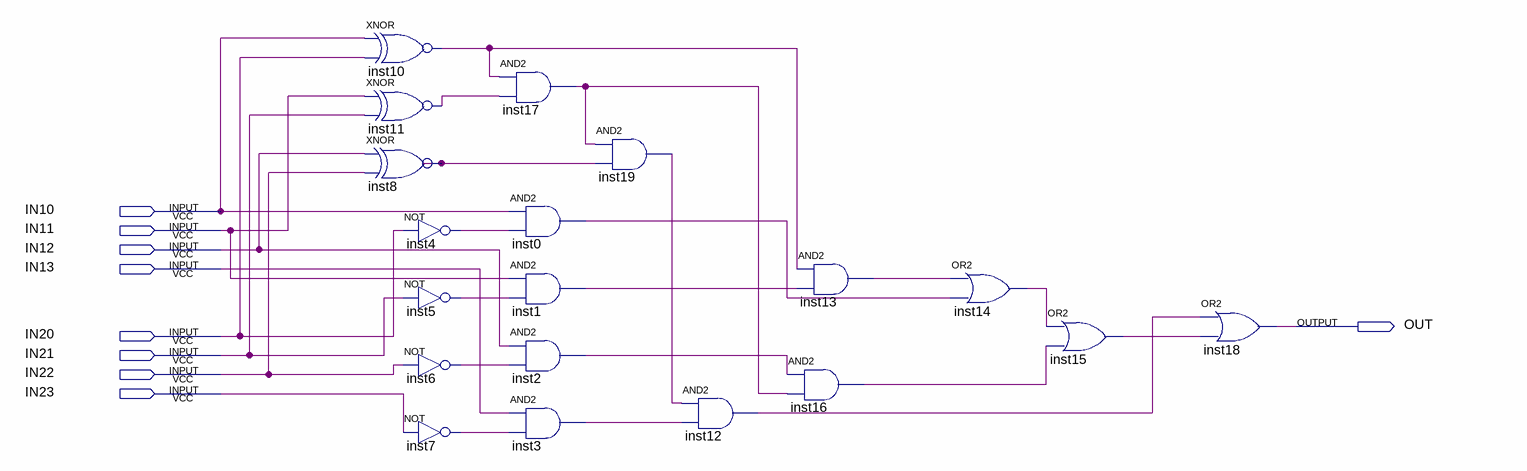
[diagram p0: schematic sheet]
// Quartus schematic sdProjectMaiorQueModulo.bdf as structural Verilog: 19 symbols, 9 pins
module sdProjectMaiorQueModulo (
  input  IN10,
  input  IN11,
  input  IN12,
  input  IN13,
  input  IN20,
  input  IN21,
  input  IN22,
  input  IN23,
  output OUT
);

  wire inst0_out, inst1_out, inst2_out, inst3_out, inst4_out, inst5_out, inst6_out, inst7_out, inst8_out,
       inst10_out, inst11_out, inst12_out, inst13_out, inst14_out, inst15_out, inst16_out, inst17_out,
       inst19_out;

  xnor inst10 (inst10_out, IN10, IN20);
  xnor inst11 (inst11_out, IN11, IN21);
  xnor inst8 (inst8_out, IN12, IN22);
  not inst4 (inst4_out, IN20);
  not inst5 (inst5_out, IN21);
  not inst6 (inst6_out, IN22);
  not inst7 (inst7_out, IN23);
  and inst17 (inst17_out, inst10_out, inst11_out);
  and inst0 (inst0_out, IN10, inst4_out);
  and inst1 (inst1_out, IN11, inst5_out);
  and inst2 (inst2_out, IN12, inst6_out);
  and inst3 (inst3_out, IN13, inst7_out);
  and inst19 (inst19_out, inst17_out, inst8_out);
  and inst12 (inst12_out, inst19_out, inst3_out);
  and inst13 (inst13_out, inst10_out, inst1_out);
  and inst16 (inst16_out, inst2_out, inst17_out);
  or inst14 (inst14_out, inst13_out, inst0_out);
  or inst15 (inst15_out, inst14_out, inst16_out);
  or inst18 (OUT, inst12_out, inst15_out);
endmodule
